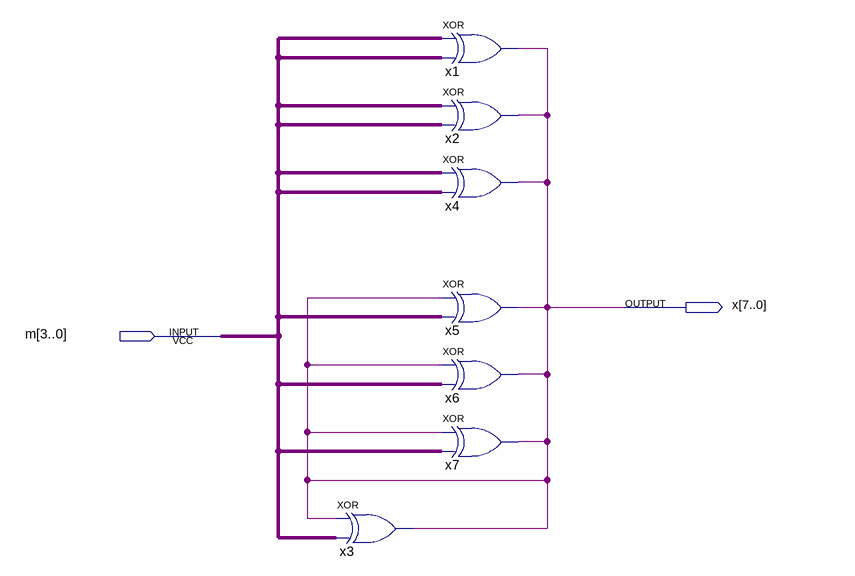
[diagram p0: schematic sheet]
// Quartus schematic paralEcn.bdf as structural Verilog: 7 symbols, 2 pins
module paralEcn (
  input  [3:0] m,
  output [7:0] x
);

  wire x3_out;

  assign x3_out = {4{x3_out}} ^ m;  // XOR x3, 4 bits wide
  assign x3_out = m ^ m;  // XOR x1, 4 bits wide
  assign x3_out = m ^ m;  // XOR x2, 4 bits wide
  assign x3_out = m ^ m;  // XOR x4, 4 bits wide
  assign x3_out = {4{x3_out}} ^ m;  // XOR x5, 4 bits wide
  assign x3_out = {4{x3_out}} ^ m;  // XOR x6, 4 bits wide
  assign x3_out = {4{x3_out}} ^ m;  // XOR x7, 4 bits wide
endmodule
